# Altium schematic sheet TLM_002_MCP3021.SchDoc: =DocumentName
size A4; CompanyName: Scopa Industries LLC; Engineer: Nazar Lysenko / Andrii Antonenko; Organization: Scopa Industries LLC; Address1: Kyiv; Address2: Ukraine; Address3: https://www.scopa.industries/; Address4: oleksyi.y@scopa.industries; SheetNumber: 8; SheetTotal: 11
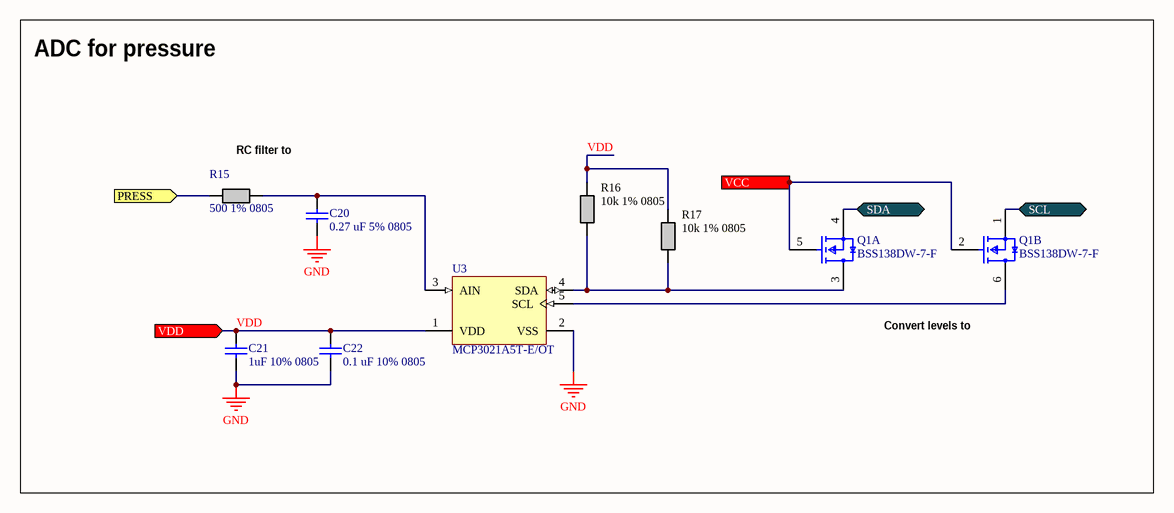
[diagram p0: TLM_002_MCP3021.SchDoc]

## Parts
C20  0.27 uF 5% 0805  [CAPC2013X145X50ML20T20]
C21  1uF 10% 0805  [CAPC2013X145X50NL20T20]
C22  0.1 uF 10% 0805  [CAPC2013X140X50ML20T25]
Q1  BSS138DW-7-F  [FP-SOT363-IPC_B]  (parts A,B of 2)
R15  500 1% 0805  [RES_0805]
R16  10k 1% 0805  [RES_0805]
R17  10k 1% 0805  [RES_0805]
U3  MCP3021A5T-E/OT  [SOT-23-OT5_L]

## Ports
PRESS (in, see TLM_002_MBR[3C], TLM_002_CONNECT[1C]), SCL (bidir, see TLM_002_MBR[3C], TLM_002_CONNECT[1B], TLM_002_DS3231SN_RTC[2B], TLM_002_ESP32S3[2B], TLM_002_INA228[2B]), SDA (bidir, see TLM_002_MBR[3C], TLM_002_CONNECT[1B], TLM_002_DS3231SN_RTC[2B], TLM_002_ESP32S3[2B], TLM_002_INA228[2B]), VCC (in, see TLM_002_MBR[3C], TLM_002_DS3231SN_RTC[2B], TLM_002_ESP32S3[1A], TLM_002_INA228[1B], TLM_002_LoRa[2B], TLM_002_MAX6675[2B], TLM_002_MAX31856[1B], TLM_002_SD[1B]), VDD (in, see TLM_002_MBR[3C])

## Nets
GND: C20.1 C21.1 C22.1 U3.2(VSS)
PRESS: R15.1 ; port PRESS
SCL: Q1.1(S2) ; port SCL
SDA: Q1.4(S1) ; port SDA
VCC: Q1.2(G2) Q1.5(G1) ; port VCC
VDD: C21.2 C22.2 R16.1 R17.1 U3.1(VDD) ; port VDD
NetC20_2: C20.2 R15.2 U3.3(AIN)
NetQ1_3: Q1.3(D1) R16.2 R17.2 U3.4(SDA)
NetQ1_6: Q1.6(D2) U3.5(SCL)

## Notes on the sheet
- ADC for pressure sensor
- RC filter to 1kHz
- Convert levels to 3V3
- Title
- Size:
- Date:
- A4
- Author:
- Time:
- Sheet
- Revision:
- of
- File:

## Library data of the parts
C20 = CMP-2007-01595-1: Part Number: VJ0805Y274JXXTW1BC; Manufacturer: Vitramon
C21 = CMP-2007-01676-1: Part Number: VJ0805Y105KXQRW1BC; Manufacturer: Vitramon
C22 = CMP-2007-04651-1: Part Number: 0805DD104KAT2A; Manufacturer: AVX Interconnect / Elco
Q1 = CMP-2000-05966-3: MOSFET 2N-CH 50V 0.2A SC70-6; Drain to Source Resistance: 3.5R; Current Rating: 200mA; Number of Channels: 2; Element Configuration: Dual; Threshold Voltage: 1.2V; Power Dissipation: 200mW; Turn-On Delay Time: 20ns; FET Type: 2 N-Channel; Gate to Source Voltage (Vgs): 20V; Input Capacitance: 50pF; Max Operating Temperature: 150°C; Number of Terminals: 6; Mount: Surface Mount; Number of Pins: 6; Packaging: Tape and Reel; Min Breakdown Voltage: 50V; REACH SVHC: No SVHC; Contact Plating: Tin; Min Operating Temperature: -55°C; Drain to Source Voltage (Vdss): 50V; Case/Package: SOT-363; On-State Resistance: 3.5R; Height: 1mm; Continuous Drain Current (ID): 200mA; Turn-Off Delay Time: 20ns; Lead Free: Lead Free; Number of Elements: 2; Max Power Dissipation: 200mW; Width: 1.35mm; Package Quantity: 3000; Length: 2.2mm; Drain to Source Breakdown Voltage: 50V; Voltage Rating (DC): 50V; Nominal Vgs: 1.2V; Rds On Max: 3.5R; Weight: 0.000212oz
R15 = Resistor_500: Resistor 500Ohm 1% SMD 0805 Generic; Value: 500; Package size: 0805; Tolerance: 1%
R16 R17 = Resistor_10k: Resistor 10kOhm 1% SMD 0805 Generic; Package size: 0805; Tolerance: 1%; Value: 10k
U3 = CMP-0188-00725-2: Low Power 10-Bit A/D Converter With I2C Interface, 5-Pin SOT-23, Extended Temperature, Tape and Reel; PackageVersion: revBB, Aug-2009; ComponentLink1Description: Manufacturer URL; PackageReference: SOT-23-OT5; DatasheetVersion: revA, May-2003; RevisionNote: URLs added.; ComponentLink2URL: http://ww1.microchip.com/downloads/en/DeviceDoc/21805a.pdf; Code_IPC: SOT23-5; ComponentLink1URL: http://www.microchip.com/; ComponentLink3URL: http://www.microchip.com/stellent/groups/techpub_sg/documents/packagingspec/en012702.pdf; ComponentLink3Description: Package Specification; PackageDescription: 5-Lead Plastic Small Outline Transistor (OT) [SOT-23]; ComponentLink2Description: Datasheet